# Altium schematic sheet PAGE4 - SENSORS.SchDoc
size A3; DocumentNumber: 1; SheetNumber: 1; SheetTotal: 2
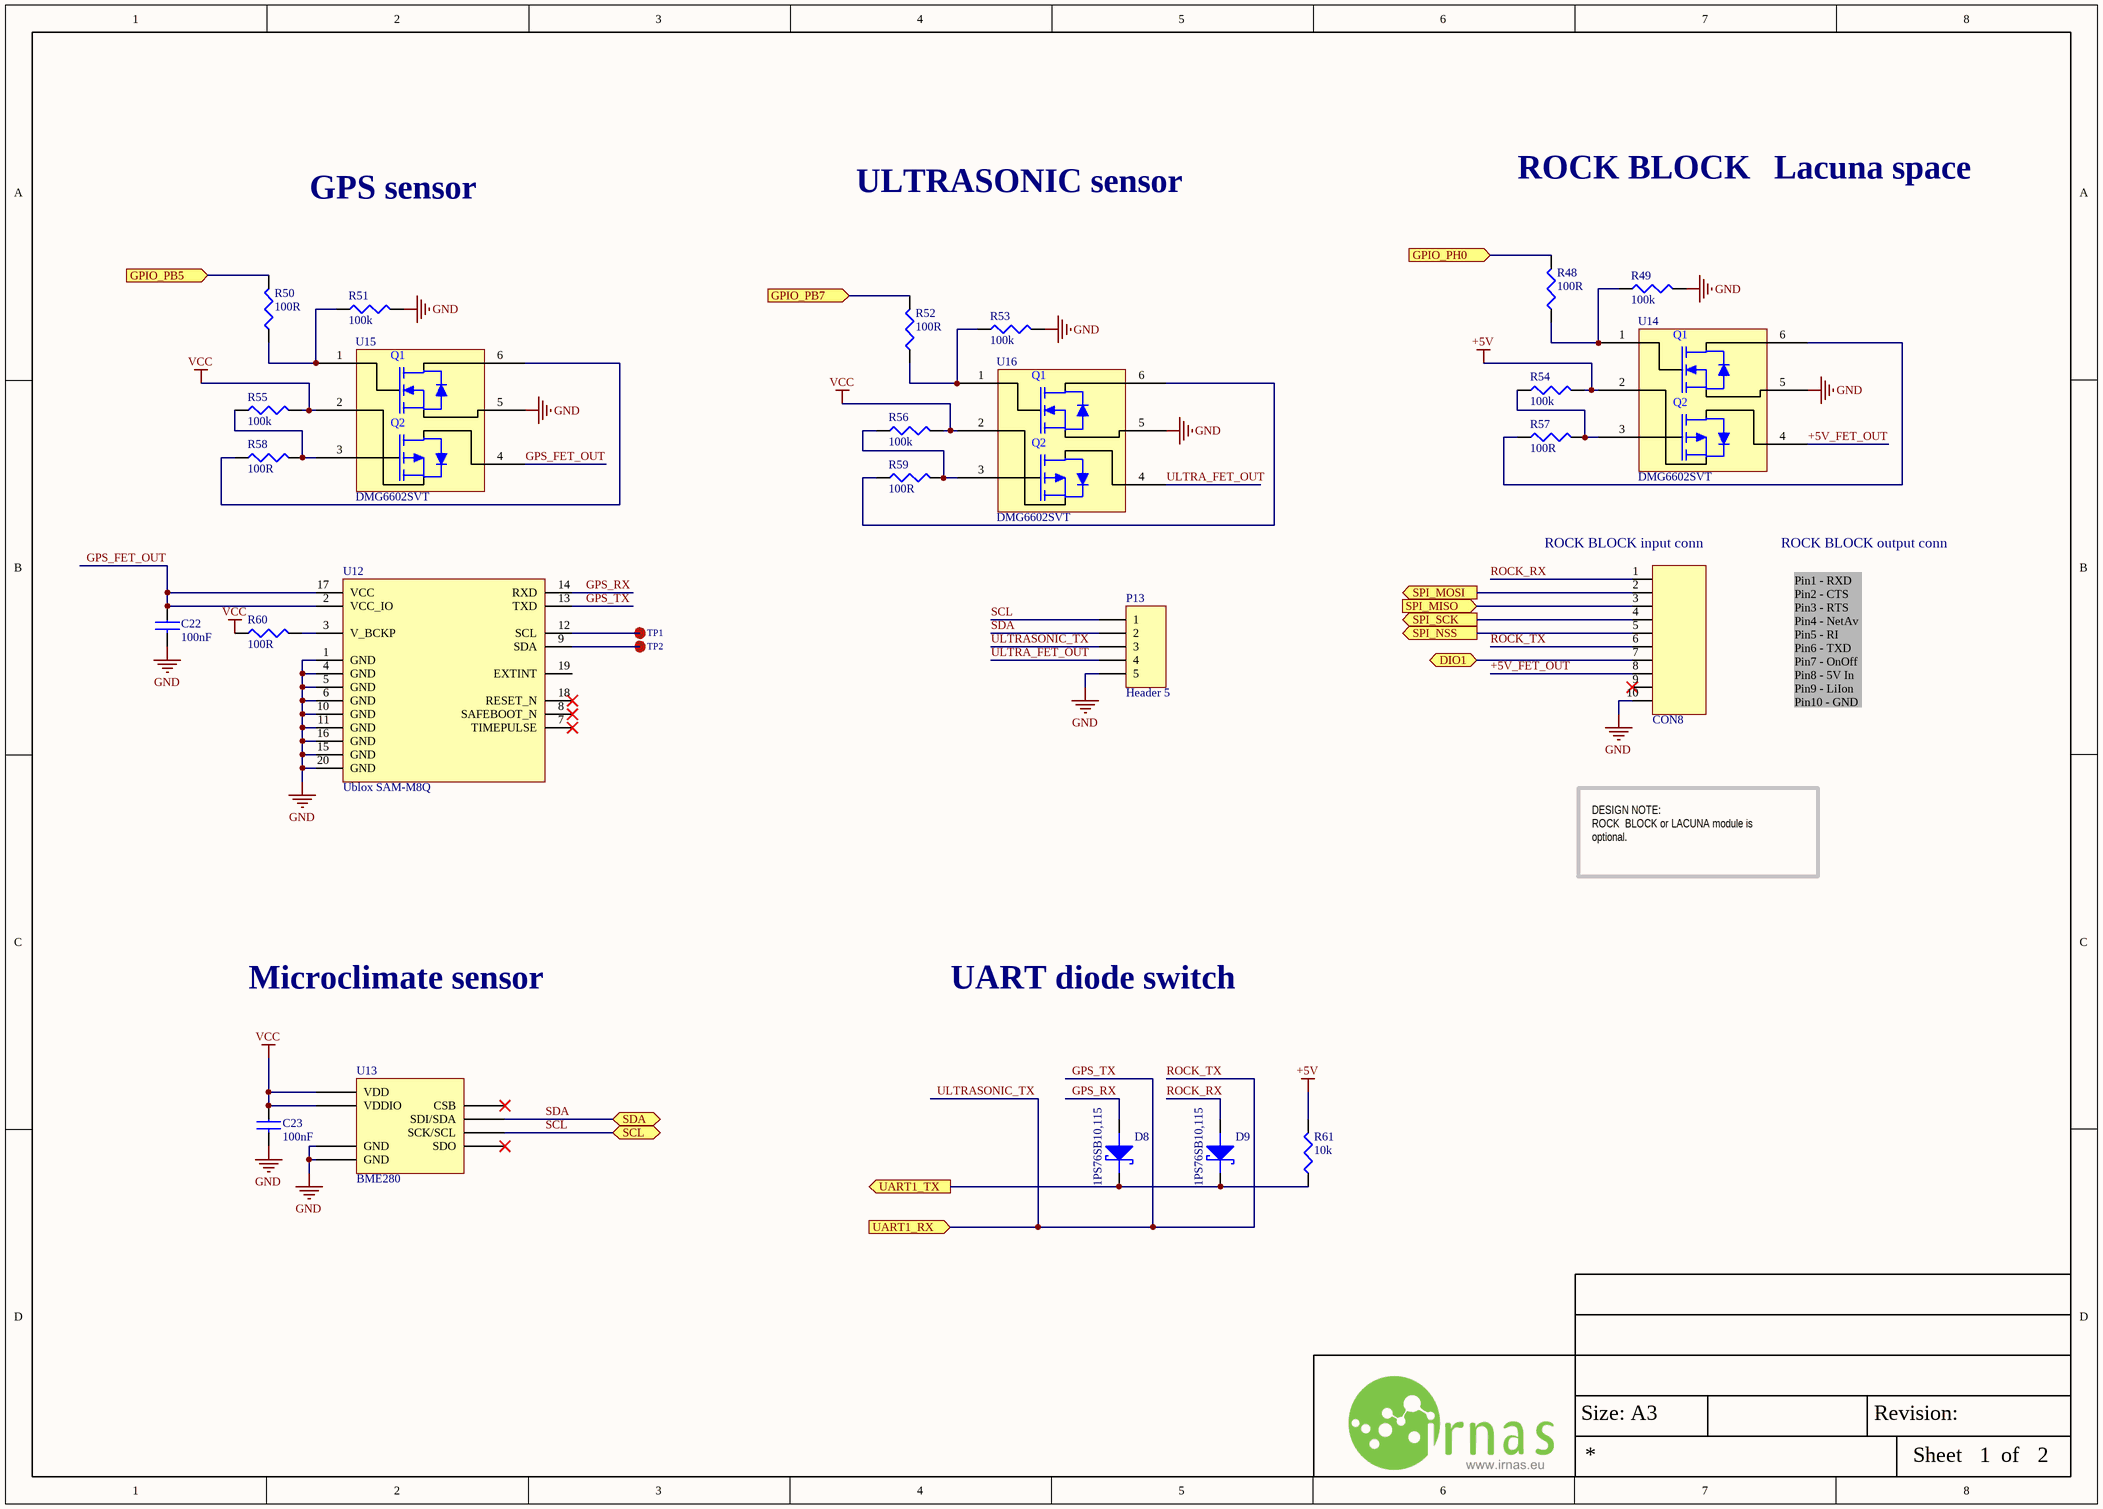
[diagram p0: PAGE4 - SENSORS.SchDoc]

## Parts
C22  100nF  [CAP0603]
C23  100nF  [CAP0603]
CON8  53261-1071  [PICOBLADE 10PIN]  (value not drawn)
D8  1PS76SB10,115  [SOD-323]
D9  1PS76SB10,115  [SOD-323]
P13  Header 5  [HDR1X5]
R48  100R  [RES0603]
R49  100k  [RES0603]
R50  100R  [RES0603]
R51  100k  [RES0603]
R52  100R  [RES0603]
R53  100k  [RES0603]
R54  100k  [RES0603]
R55  100k  [RES0603]
R56  100k  [RES0603]
R57  100R  [RES0603]
R58  100R  [RES0603]
R59  100R  [RES0603]
R60  100R  [RES0603]
R61  10k  [RES0603]
TP1  TestPoint  [TestPoint:1.2x1.2mm]  (value not drawn)
TP2  TestPoint  [TestPoint:1.2x1.2mm]  (value not drawn)
U12  Ublox SAM-M8Q  [SAM-M8Q]
U13  BME280  [BME280]
U14  DMG6602SVT  [TSOT26]
U15  DMG6602SVT  [TSOT26]
U16  DMG6602SVT  [TSOT26]

## Ports
DIO1 (bidir), GPIO_PB5 (in), GPIO_PB7 (in), GPIO_PH0 (in), SCL (bidir), SDA (bidir), SPI_MISO (in), SPI_MOSI (out), SPI_NSS (out), SPI_SCK (out), UART1_RX (in), UART1_TX (out)

## Nets
+5V: R54.2 R61.2 U14.2(S2)
GND: C22.2 C23.2 CON8.10 P13.5 R49.2 R51.2 R53.2 U12.1(GND) U12.4(GND) U12.5(GND) U12.6(GND) U12.10(GND) U12.11(GND) U12.15(GND) U12.16(GND) U12.20(GND) U13.1(GND) U13.7(GND) U14.5(S1) U15.5(S1) U16.5(S1)
VCC: C23.1 R55.2 R56.2 R60.1 U13.6(VDDIO) U13.8(VDD) U15.2(S2) U16.2(S2)
+5V_FET_OUT: CON8.8 U14.4(D2)
DIO1: CON8.7 ; port DIO1
GPIO_PB5: R50.2 ; port GPIO_PB5
GPIO_PB7: R52.2 ; port GPIO_PB7
GPIO_PH0: R48.2 ; port GPIO_PH0
GPS_FET_OUT: C22.1 U12.2(VCC_IO) U12.17(VCC) U15.4(D2)
GPS_RX: D8.2(ANODE) U12.14(RXD)
GPS_TX: CON8.6 P13.3 U12.13(TXD) ; port UART1_RX  [also labelled ROCK_TX, ULTRASONIC_TX]
ROCK_RX: CON8.1 D9.2(ANODE)
SCL: P13.1 U13.4(SCK/SCL) ; port SCL
SDA: P13.2 U13.3(SDI/SDA) ; port SDA
SPI_MISO: CON8.3 ; port SPI_MISO
SPI_MOSI: CON8.2 ; port SPI_MOSI
SPI_NSS: CON8.5 ; port SPI_NSS
SPI_SCK: CON8.4 ; port SPI_SCK
UART1_TX: D8.1(cathode) D9.1(cathode) R61.1 ; port UART1_TX
ULTRA_FET_OUT: P13.4 U16.4(D2)
NetR48_1: R48.1 R49.1 U14.1(G1)
NetR50_1: R50.1 R51.1 U15.1(G1)
NetR52_1: R52.1 R53.1 U16.1(G1)
NetR54_1: R54.1 R57.2 U14.3(G2)
NetR55_1: R55.1 R58.2 U15.3(G2)
NetR56_1: R56.1 R59.2 U16.3(G2)
NetR57_1: R57.1 U14.6(D1)
NetR58_1: R58.1 U15.6(D1)
NetR59_1: R59.1 U16.6(D1)
NetR60_2: R60.2 U12.3(V_BCKP)
NetTP1_0: TP1.0 U12.12(SCL)
NetTP2_0: TP2.0 U12.9(SDA)

Not connected (* = marked no-connect by the designer): CON8 9*; U12 7(TIMEPULSE)* 8(SAFEBOOT_N)* 18(RESET_N)* 19(EXTINT); U13 2(CSB)* 5(SDO)*

## Notes on the sheet
- ROCK BLOCK
- Lacuna space
- GPS sensor
- ULTRASONIC sensor
- (near CON8) ROCK BLOCK input conn
- ROCK BLOCK output conn
- Pin1 - RXD
  Pin2 - CTS
  Pin3 - RTS
  Pin4 - NetAv
  Pin5 - RI
  Pin6 - TXD
  Pin7 - OnOff
  Pin8 - 5V In
  Pin9 - LiIon
  Pin10 - GND
- DESIGN NOTE:
  ROCK  BLOCK or LACUNA module is optional.
- Microclimate sensor
- UART diode switch
- Size: A3
- Revision:
- Sheet
- of
- (in symbol T_M - DMG6602SVT) Q1; Q2

## Library data of the parts
C22 C23 = C - 100nF: MURATA - GRM188R71C104KA01J - CAP, MLCC, X7R, 0.1UF, 16V, 0603; IRNAS Part No.: I-200005; Ceramic Capacitor Case: 0603 [1608 Metric]; Capacitance: 0.1; Voltage Rating: 16; Capacitance Tolerance: ± 10%; Dielectric Characteristic: X7; Product Range: GRM Series; SVHC: No SVHC (20-Jun-2016; Supplier 1: Farnell; Manufacturer: MURATA; Manufacturer Part Number: GRM188R71C104KA01J; RoHS: YES; Stock 1: 18297; Pricing 1: 10=0.0145, 100=0.0126, 500=0.0081, 2500=0.0059, 5000=0.0052, 10000=0.0046, 50000=0.0036, 100000=0.0035 (GBP); Packaging: Cut Tape; Operating Temperature Min: -55; Operating Temperature Max: 125; Automotive Qualification Standard: -; MSL: MSL 1 - Unlimited; ComponentLink1URL: http://www.farnell.com/datasheets/2189124.pdf; ComponentLink1Description: http://www.farnell.com/datasheets/2189124.pdf; Supplier Part Number 1: 2688519
CON8 = PicoBlade 10pin: Wire-To-Board Connector, Right Angle, 1.25 mm, 10 Contacts, Header, PicoBlade 53261 Series; ComponentLink1Description: Datasheet; ComponentLink1URL: http://www.farnell.com/datasheets/2697773.pdf?_ga=2.235245378.2144023421.1568612611-1741076818.1563951383; Supplier 1: Farnell; Supplier Part Number 1: 1125377
D8 D9 = DS - 1PS76SB10,115: Small Signal Schottky Diode, Single, 30 V, 200 mA, 320 mV, 800 mA, 125 °C; ComponentLink1Description: Datasheet; ComponentLink1URL: http://www.farnell.com/datasheets/1751003.pdf?_ga=2.25685246.2144023421.1568612611-1741076818.1563951383; Supplier 1: Farnell; Supplier Part Number 1: 1081179
P13 = Header 5: Header, 5-Pin; LatestRevisionDate: 17-Jul-2002; LatestRevisionNote: Re-released for DXP Platform.; Publisher: Altium Limited; Supplier Part Number 1: Header 2.54 mm
R48 R50 R52 R57-R60 = R - 100R: MULTICOMP - MC0063W06031100R - RES, THICK FILM, 100R, 1%, 0.063W, 0603; IRNAS Part No.: I-100009; Resistance: 100; Voltage Rating: 50; Resistor Case Style: 0603 [1608 Metric]; Power Rating: 63; Product Range: MC Series; Temperature Coefficient: ± 200; SVHC: No SVHC (12-Jan-2017); External Depth: 0.45; External Length / Height: 1.6; External Width: 0.8; No. of Pins: 2; Reel Quantity: 5000; Resistor Mounting: Surface Mount Device; Temperature Coeff. +: 200; Voltage Rating V DC: 50V<!--FANDB--><div class="features-and-benefits-container"><div class="features-and-benefits-description"><span class="features-benefits-value">The Multicomp MC series current sense resistors are thick film chip resistors. The resistance range includes E96 and E24 decade values from 1ohm to 10Mohm.</span></div><div class="features-and-benefits-list"><ul class="features-and-benefits-list-list"><li class="features-and-benefits-list-item">EIA 0402, 0603, 0805, 1206 chip sizes available</li><li class="features-and-benefits-list-item">Small size and low weight</li><li class="features-and-benefits-list-item">Suitable for both wave and reflow soldering</li><li class="features-and-benefits-list-item">Reduction of assembly costs</li><li class="features-and-benefits-list-item">Maximum working voltage of 50V(0402, 0603), 150V(0805), 200V(1206)</li><li class="features-and-benefits-list-item">Available in ±1%, ±2% and ±5% tolerance</li><li class="features-and-benefits-list-item">Power rating of 62.5mW, 100mW and 125mW</li><li class="features-and-benefits-list-item">±400ppm/°C(1ohm to 10ohm), ±200ppm/°C(11ohm to 100ohm), ±100; Supplier 1: Farnell; Manufacturer: MULTICOMP; Manufacturer Part Number: MC0063W06031100R; RoHS: Y-EX; Stock 1: 78152; Pricing 1: 10=0.0011, 100=0.001, 500=0.0009, 1000=0.0008, 2500=0.0007 (GBP); Resistance Tolerance: ± 1%; Packaging: Cut Tape; Resistor Element Material: Thick Film; Automotive Qualification Standard: -; Operating Temperature Max: 155; Operating Temperature Min: -55; Operating Temperature Range: -55°C to +155; Tape Width: 8; Temperature Coeff. -: 200; Tolerance +: 1%; Tolerance -: 1%; ComponentLink1URL: http://www.farnell.com/datasheets/1788326.pdf; ComponentLink1Description: http://www.farnell.com/datasheets/1788326.pdf; ComponentLink2URL: http://www.farnell.com/cad/1561149.zip; ComponentLink2Description: http://www.farnell.com/cad/1561149.zip; ComponentLink3URL: http://www.farnell.com/datasheets/2289252.pdf; ComponentLink3Description: http://www.farnell.com/datasheets/2289252.pdf; Supplier Part Number 1: 9330364
R49 R51 R53-R56 = R - 100k: MULTICOMP - MCMR06X104 JTL - RES, CERAMIC, 100K, 5%, 0.1W, 0603; IRNAS Part No.: I-100007; Resistance: 100; Voltage Rating: 75; Resistor Case Style: 0603 [1608 Metric]; Product Range: MCMR Series; Temperature Coefficient: ± 100; Resistor Mounting: Surface Mount Device<!--FANDB--><div class="features-and-benefits-container"><div class="features-and-benefits-description"><span class="features-benefits-value">The Multicomp MCMR series resistors are automotive grade, anti sulphured thick film chip resistor. The resistance range includes E24 and E96 decade values from 1ohm to 10Mohm. These resistors are constructed on top of a high grade ceramic body.</span></div><div class="features-and-benefits-list"><ul class="features-and-benefits-list-list"><li class="features-and-benefits-list-item">EIA 0402, 0603, 0805, 1206 chip sizes available</li><li class="features-and-benefits-list-item">High reliability and stability</li><li class="features-and-benefits-list-item">Automotive grade AEC-Q200 compliant</li><li class="features-and-benefits-list-item">Complaint with (IEC 60068-1) 55/155/56 climatic category</li><li class="features-and-benefits-list-item">Maximum operation voltage of 50V, 75V, 150V and 200V</li><li class="features-and-benefits-list-item">Power rating of 62.5mW, 100mW, 125mW and 250mW</li><li class="features-and-benefits-list-item">Available in ±1% and ±5% tolerance</li><li class="features-and-benefits-list-item">Temperature coefficient (TCR) of +200ppm/°C, +100ppm/°C and -200ppm/°C to +400ppm/°C</li><li class="features-and-benefits-list-item">Operating temperature range -55°C to 155; Supplier 1: Farnell; Manufacturer: MULTICOMP; Manufacturer Part Number: MCMR06X104 JTL; RoHS: Y-EX; Stock 1: 187; Pricing 1: 10=0.0109, 100=0.0085, 500=0.006, 1000=0.0048, 2500=0.004, 5000=0.003, 25000=0.002, 50000=0.0016 (GBP); Power Rating: 100; Resistance Tolerance: ± 5%; Packaging: Cut Tape; Resistor Element Material: Ceramic; Automotive Qualification Standard: -; ComponentLink1URL: http://www.farnell.com/datasheets/1716707.pdf; ComponentLink1Description: http://www.farnell.com/datasheets/1716707.pdf; Supplier Part Number 1: 2073357
R61 = R - 10k: MULTICOMP - MCMR06X103 JTL - RES, CERAMIC, 10K, 5%, 0.1W, 0603; IRNAS Part No.: I-100008; Resistance: 10; Voltage Rating: 75; Resistor Case Style: 0603 [1608 Metric]; Power Rating: 100; Product Range: MCMR Series; Temperature Coefficient: ± 100; Automotive Qualification Standard: -<!--FANDB--><div class="features-and-benefits-container"><div class="features-and-benefits-description"><span class="features-benefits-value">The Multicomp MCMR series resistors are automotive grade, anti sulphured thick film chip resistor. The resistance range includes E24 and E96 decade values from 1ohm to 10Mohm. These resistors are constructed on top of a high grade ceramic body.</span></div><div class="features-and-benefits-list"><ul class="features-and-benefits-list-list"><li class="features-and-benefits-list-item">EIA 0402, 0603, 0805, 1206 chip sizes available</li><li class="features-and-benefits-list-item">High reliability and stability</li><li class="features-and-benefits-list-item">Automotive grade AEC-Q200 compliant</li><li class="features-and-benefits-list-item">Complaint with (IEC 60068-1) 55/155/56 climatic category</li><li class="features-and-benefits-list-item">Maximum operation voltage of 50V, 75V, 150V and 200V</li><li class="features-and-benefits-list-item">Power rating of 62.5mW, 100mW, 125mW and 250mW</li><li class="features-and-benefits-list-item">Available in ±1% and ±5% tolerance</li><li class="features-and-benefits-list-item">Temperature coefficient (TCR) of +200ppm/°C, +100ppm/°C and -200ppm/°C to +400ppm/°C</li><li class="features-and-benefits-list-item">Operating temperature range -55°C to 155; Supplier 1: Farnell; Manufacturer: MULTICOMP; Manufacturer Part Number: MCMR06X103 JTL; RoHS: Y-EX; Stock 1: 19791; Pricing 1: 10=0.0087, 100=0.0074, 500=0.0061, 1000=0.0048, 2500=0.0032, 5000=0.0024, 25000=0.0016, 50000=0.0013 (GBP); Resistance Tolerance: ± 5%; Packaging: Cut Tape; Resistor Element Material: Ceramic; ComponentLink1URL: http://www.farnell.com/datasheets/1716707.pdf; ComponentLink1Description: http://www.farnell.com/datasheets/1716707.pdf; Supplier Part Number 1: 2073356
TP1 TP2 = TestPoint: TEST POINT ROUND SMD; FIT: 0.94; Komp / Device: SMD; ComponentLink1Description: Datasheet
U12 = RF - UBLOX-SAM-M8Q: SAM-M8 RF Receiver BeiDou, Galileo, GLONASS, GNSS, GPS -160dBm; Manufacturer: u-blox; Manufacturer Part Number: MAX-M8Q-0; Stock 1: 10805; Supplier 1: Digi-Key; Supplier Part Number 1: 672-1054-1-ND
U13 = SEN - BME280: Humidity Temperature Sensor 0 ~ 100% RH I²C, SPI ±3% 1s Surface Mount; ComponentLink1Description: Datasheet; ComponentLink1URL: https://ae-bst.resource.bosch.com/media/_tech/media/datasheets/BST-BME280-DS002.pdf; Supplier 1: Digi-Key; Supplier Part Number 1: 828-1063-6-ND
U14-U16 = T_M - DMG6602SVT: Dual MOSFET, N and P Channel, 3.4 A, 30 V, 0.038 ohm, 10 V, 1 V; ComponentLink1Description: Datasheet; ComponentLink1URL: http://www.farnell.com/datasheets/1915929.pdf?_ga=2.95290844.1984085946.1565589483-1741076818.1563951383; Supplier 1: Farnell; Supplier Part Number 1: 2061522